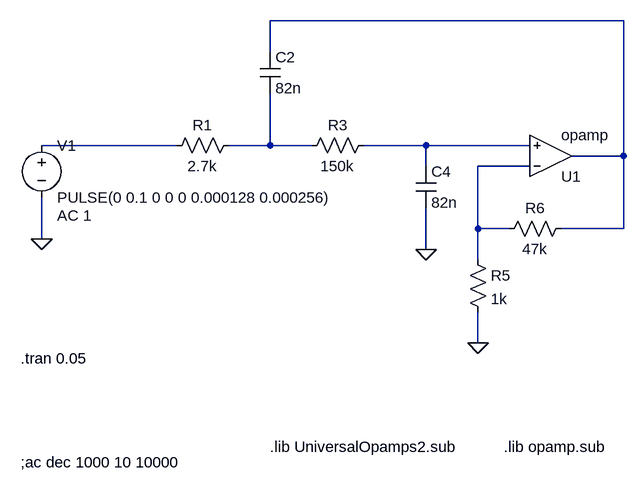
[diagram p0: schematic Filter real.asc]
Filter real.asc, the LTspice schematic file:
Version 4
SHEET 1 932 680
WIRE 448 -192 -96 -192
WIRE -96 -144 -96 -192
WIRE -240 0 -448 0
WIRE -96 0 -96 -80
WIRE -96 0 -160 0
WIRE -32 0 -96 0
WIRE 144 0 48 0
WIRE 304 0 144 0
WIRE 448 16 448 -192
WIRE 448 16 368 16
WIRE 144 32 144 0
WIRE 304 32 224 32
WIRE 224 128 224 32
WIRE 272 128 224 128
WIRE 448 128 448 16
WIRE 448 128 352 128
WIRE -448 144 -448 80
WIRE 144 160 144 96
WIRE 224 176 224 128
WIRE 224 304 224 256
FLAG 224 304 0
FLAG 144 160 0
FLAG -448 144 0
SYMBOL voltage -448 -16 R0
WINDOW 123 24 124 Left 2
WINDOW 39 0 0 Left 2
SYMATTR Value2 AC 1
SYMATTR InstName V1
SYMATTR Value PULSE(0 0.1 0 0 0 0.000128 0.000256)
SYMBOL res -144 -16 R90
WINDOW 0 0 56 VBottom 2
WINDOW 3 32 56 VTop 2
SYMATTR InstName R1
SYMATTR Value 2.7k
SYMBOL res 64 -16 R90
WINDOW 0 0 56 VBottom 2
WINDOW 3 32 56 VTop 2
SYMATTR InstName R3
SYMATTR Value 150k
SYMBOL res 208 160 R0
SYMATTR InstName R5
SYMATTR Value 1k
SYMBOL res 368 112 R90
WINDOW 0 0 56 VBottom 2
WINDOW 3 32 56 VTop 2
SYMATTR InstName R6
SYMATTR Value 47k
SYMBOL cap 128 32 R0
SYMATTR InstName C4
SYMATTR Value 82n
SYMBOL cap -112 -144 R0
SYMATTR InstName C2
SYMATTR Value 82n
SYMBOL Opamps\\opamp 336 80 M180
SYMATTR InstName U1
TEXT -480 328 Left 2 !.tran 0.05
TEXT -96 464 Left 2 !.lib UniversalOpamps2.sub
TEXT -480 488 Left 2 !;ac dec 1000 10 10000
TEXT 264 464 Left 2 !.lib opamp.sub

The netlist it stands for:
* Filter real.asc
V1 N002 0 PULSE(0 0.1 0 0 0 0.000128 0.000256) AC 1
R1 N003 N002 2.7k
R3 N004 N003 150k
R5 N005 0 1k
R6 N001 N005 47k
C4 N004 0 82n
C2 N001 N003 82n
XU1 N005 N004 N001 opamp Aol=100K GBW=10Meg  ; pins invin noninvin out
.tran 0.05
.lib UniversalOpamps2.sub
;ac dec 1000 10 10000
.lib opamp.sub
.backanno
.end